# Altium project EECS430PhasedArray.PrjPcb
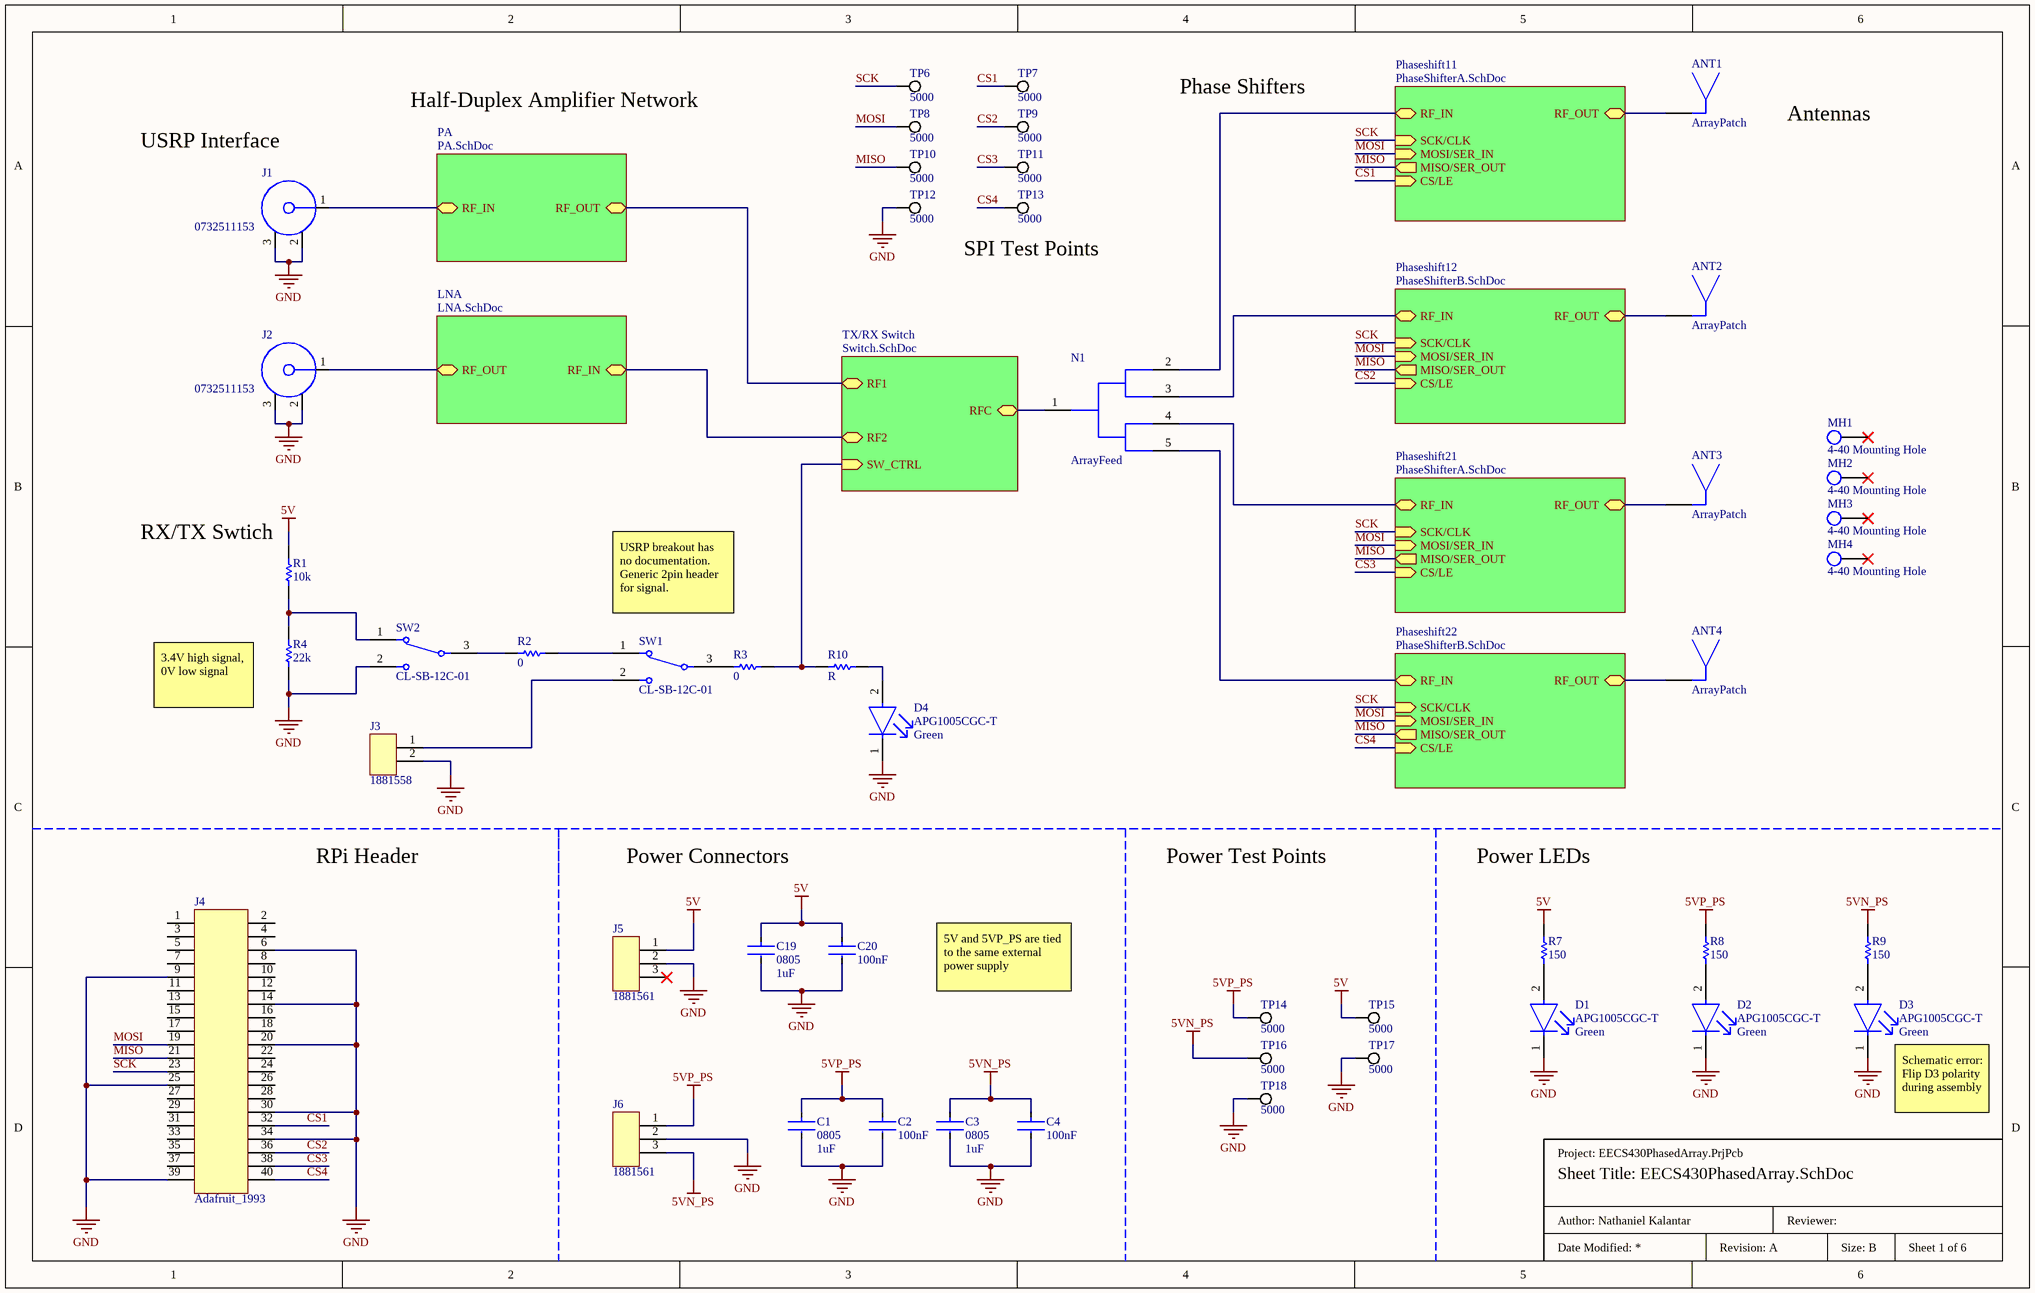
[diagram p0: EECS430PhasedArray.SchDoc]
SCH_REV: A; SCH_AUTHOR: Nathaniel Kalantar; PCB_REV: A; PCB_DESIGNER: Nathaniel Kalantar
6 sheets, 97 parts. Net scope: hierarchical (ports join the sheet entries above them; power ports are global).
Board file: EECS430PhasedArray.PcbDoc
Sheets:
  EECS430PhasedArray.SchDoc
    LNA = LNA.SchDoc
    PA = PA.SchDoc
    TX/RX Switch = Switch.SchDoc
    Phaseshift11 = PhaseShifterA.SchDoc
    Phaseshift12 = PhaseShifterB.SchDoc
    Phaseshift21 = PhaseShifterA.SchDoc
    Phaseshift22 = PhaseShifterB.SchDoc

## Sheet EECS430PhasedArray.SchDoc
size B; ENG_APP_DATE: --/--/--; DSN_APP_DATE: --/--/--; CHK_APP_DATE: --/--/--; Organization: MASA; SheetNumber: 1; SheetTotal: 6

### Parts
ANT1  ArrayPatch  [ArrayPatch]
ANT2  ArrayPatch  [ArrayPatch]
ANT3  ArrayPatch  [ArrayPatch]
ANT4  ArrayPatch  [ArrayPatch]
C1  value 1uF  Package: 0805  [FP-0805-Capacitor-CL21-IPC_B]  (hidden comment: Ceramic Capacitor 0805)
C2  value 100nF  [FP-0603-Capacitor-CL10-IPC_B]  (hidden comment: Ceramic Capacitor 0603)
C3  value 1uF  Package: 0805  [FP-0805-Capacitor-CL21-IPC_B]  (hidden comment: Ceramic Capacitor 0805)
C4  value 100nF  [FP-0603-Capacitor-CL10-IPC_B]  (hidden comment: Ceramic Capacitor 0603)
C19  value 1uF  Package: 0805  [FP-0805-Capacitor-CL21-IPC_B]  (hidden comment: Ceramic Capacitor 0805)
C20  value 100nF  [FP-0603-Capacitor-CL10-IPC_B]  (hidden comment: Ceramic Capacitor 0603)
D1  APG1005CGC-T  Color: Green  [FP-APG1005CGC-T-MFG]
D2  APG1005CGC-T  Color: Green  [FP-APG1005CGC-T-MFG]
D3  APG1005CGC-T  Color: Green  [FP-APG1005CGC-T-MFG]
D4  APG1005CGC-T  Color: Green  [FP-APG1005CGC-T-MFG]
J1  0732511153  [0732511153]
J2  0732511153  [0732511153]
J3  1881558  [1881558]
J4  Adafruit_1993  [Aadafruit_1993]
J5  1881561  [1881561]
J6  1881561  [1881561]
MH1  4-40 Mounting Hole  [4-40 Mounting Hole]
MH2  4-40 Mounting Hole  [4-40 Mounting Hole]
MH3  4-40 Mounting Hole  [4-40 Mounting Hole]
MH4  4-40 Mounting Hole  [4-40 Mounting Hole]
N1  ArrayFeed  [ArrayFeed]  (net tie, no BOM)
R1  value 10k  [RESC1608X55X25NL10T15]  (hidden comment: RC0603FR-072K2L)
R2  value 0  [RESC1608X55X25NL10T15]  (hidden comment: RC0603FR-072K2L)
R3  value 0  [RESC1608X55X25NL10T15]  (hidden comment: RC0603FR-072K2L)
R4  value 22k  [RESC1608X55X25NL10T15]  (hidden comment: RC0603FR-072K2L)
R7  value 150  [RESC1608X55X25NL10T15]  (hidden comment: RC0603FR-072K2L)
R8  value 150  [RESC1608X55X25NL10T15]  (hidden comment: RC0603FR-072K2L)
R9  value 150  [RESC1608X55X25NL10T15]  (hidden comment: RC0603FR-072K2L)
R10  value R  [RESC1608X55X25NL10T15]  (hidden comment: RC0603FR-072K2L)
SW1  CL-SB-12C-01  [CL-SB-12C-01]
SW2  CL-SB-12C-01  [CL-SB-12C-01]
TP6  5000  [FP-5000-MFG]
TP7  5000  [FP-5000-MFG]
TP8  5000  [FP-5000-MFG]
TP9  5000  [FP-5000-MFG]
TP10  5000  [FP-5000-MFG]
TP11  5000  [FP-5000-MFG]
TP12  5000  [FP-5000-MFG]
TP13  5000  [FP-5000-MFG]
TP14  5000  [FP-5000-MFG]
TP15  5000  [FP-5000-MFG]
TP16  5000  [FP-5000-MFG]
TP17  5000  [FP-5000-MFG]
TP18  5000  [FP-5000-MFG]

### Sub-sheets
LNA = LNA.SchDoc: RF_OUT (bidir), RF_IN (bidir)
PA = PA.SchDoc: RF_IN (bidir), RF_OUT (bidir)
Phaseshift11 = PhaseShifterA.SchDoc: SCK/CLK (in), MOSI/SER_IN (in), MISO/SER_OUT (out), CS/LE (in), RF_IN (bidir), RF_OUT (bidir)
Phaseshift12 = PhaseShifterB.SchDoc: SCK/CLK (in), MOSI/SER_IN (in), MISO/SER_OUT (out), CS/LE (in), RF_IN (bidir), RF_OUT (bidir)
Phaseshift21 = PhaseShifterA.SchDoc: SCK/CLK (in), MOSI/SER_IN (in), MISO/SER_OUT (out), CS/LE (in), RF_IN (bidir), RF_OUT (bidir)
Phaseshift22 = PhaseShifterB.SchDoc: SCK/CLK (in), MOSI/SER_IN (in), MISO/SER_OUT (out), CS/LE (in), RF_IN (bidir), RF_OUT (bidir)
TX/RX Switch = Switch.SchDoc: RFC (bidir), RF1 (bidir), RF2 (bidir), SW_CTRL (in)

### Nets
5V: C19.1 C20.1 J5.1 R1.2 R7.2 TP15.1
5VN_PS: C3.1 C4.1 J6.3 R9.1 TP16.1
5VP_PS: C1.1 C2.1 J6.1 R8.2 TP14.1
GND: C1.2 C2.2 C3.2 C4.2 C19.2 C20.2 D1.1(C) D2.1(C) D3.1(C) D4.1(C) J1.2 J1.3 J2.2 J2.3 J3.2 J4.6 J4.9 J4.14 J4.20 J4.25 J4.30 J4.34 J4.39 J5.2 J6.2 R4.1 SW2.2 TP12.1 TP17.1 TP18.1
CS1: J4.32 TP7.1 ; sheet Phaseshift11/CS/LE
CS2: J4.36 TP9.1 ; sheet Phaseshift12/CS/LE
CS3: J4.38 TP11.1 ; sheet Phaseshift21/CS/LE
CS4: J4.40 TP13.1 ; sheet Phaseshift22/CS/LE
MISO: J4.21 TP10.1 ; sheet Phaseshift11/MISO/SER_OUT, sheet Phaseshift12/MISO/SER_OUT, sheet Phaseshift21/MISO/SER_OUT, sheet Phaseshift22/MISO/SER_OUT
MOSI: J4.19 TP8.1 ; sheet Phaseshift11/MOSI/SER_IN, sheet Phaseshift12/MOSI/SER_IN, sheet Phaseshift21/MOSI/SER_IN, sheet Phaseshift22/MOSI/SER_IN
SCK: J4.23 TP6.1 ; sheet Phaseshift11/SCK/CLK, sheet Phaseshift12/SCK/CLK, sheet Phaseshift21/SCK/CLK, sheet Phaseshift22/SCK/CLK
NetANT1_1: ANT1.1(ANT) ; sheet Phaseshift11/RF_OUT
NetANT2_1: ANT2.1(ANT) ; sheet Phaseshift12/RF_OUT
NetANT3_1: ANT3.1(ANT) ; sheet Phaseshift21/RF_OUT
NetANT4_1: ANT4.1(ANT) ; sheet Phaseshift22/RF_OUT
NetC8_1: sheet LNA/RF_IN, sheet TX/RX Switch/RF2
NetC16_1: R3.1 R10.2 ; sheet TX/RX Switch/SW_CTRL
NetD1_2: D1.2(A) R7.1
NetD2_2: D2.2(A) R8.1
NetD3_2: D3.2(A) R9.2
NetD4_2: D4.2(A) R10.1
NetJ1_1: J1.1 ; sheet PA/RF_IN
NetJ2_1: J2.1 ; sheet LNA/RF_OUT
NetJ3_1: J3.1 SW1.2
NetN1_1: N1.1(RFC) ; sheet TX/RX Switch/RFC
NetN1_2: N1.2(RF1) ; sheet Phaseshift11/RF_IN
NetN1_3: N1.3(RF2) ; sheet Phaseshift12/RF_IN
NetN1_4: N1.4(RF3) ; sheet Phaseshift21/RF_IN
NetN1_5: N1.5(RF4) ; sheet Phaseshift22/RF_IN
NetR1_1: R1.1 R4.2 SW2.1
NetR2_1: R2.1 SW1.1
NetR2_2: R2.2 SW2.3
NetR3_2: R3.2 SW1.3
NetU2_5: sheet PA/RF_OUT, sheet TX/RX Switch/RF1

Not connected (* = marked no-connect by the designer): J4 1 2 3 4 5 7 8 10 11 12 13 15 16 17 18 22 24 26 27 28 29 31 33 35 37; J5 3*; MH1 1*; MH2 1*; MH3 1*; MH4 1*

### Notes on the sheet
- Half-Duplex Amplifier Network
- Phase Shifters
- USRP Interface
- Antennas
- (near TP13) SPI Test Points
- (near R1) RX/TX Swtich
- USRP breakout has no documentation.
  Generic 2pin header for signal.
- (near R4) 3.4V high signal, 0V low signal
- RPi Header
- Power Connectors
- Power Test Points
- Power LEDs
- 5V and 5VP_PS are tied to the same external power supply
- (near D3) Schematic error:
  Flip D3 polarity during assembly
- Size: B

### Library data of the parts
ANT1-ANT4 = ArrayPatch: Copper footprint for patch antenna element
C1 C3 C19 = Ceramic Capacitor 0805: CAP CER 50V X7R 0805; Manufacturer: KEMET; Manufacturer Part Number: C0603C104K5RACTU; Tolerance: 0.1; Temperature Coefficient: 30ppm/°C; Automotive Grade: Grade 1; Temperature: -55°C to +125°C; RoHS: TRUE; Material: Ceramic; Temperature Range High: +125°C; Lead Free: Yes; Octopart: https://octopart.com/c0603c104k5ractu-kemet-139244; Digikey Description: CAP CER 0.1UF 50V X7R 0603; Category: Cap; ComponentLink2Description: Datasheet; Temperature Range Low: -55°C; Device Class L1: Passive Components; Voltage Rating: 50 V; Automotive: Yes; Device Class L3: Ceramic Capacitors; ComponentLink2URL: https://api.kemet.com/component-edge/download/datasheet/C0603C100J5GACAUTO.pdf; Device Class L2: Capacitors; Temperature Characteristic: X7R; Height: 0.87mm; Supplier 1: Arrow Electronics; Supplier Part Number 1: CL21B105KBFNNNG
C2 C4 C20 = Ceramic Capacitor 0603: CAP CER 50V X7R 0603; Manufacturer: KEMET; Manufacturer Part Number: C0603C104K5RACTU; Tolerance: 0.1; Temperature Coefficient: 30ppm/°C; Automotive Grade: Grade 1; Temperature: -55°C to +125°C; RoHS: TRUE; Material: Ceramic; Temperature Range High: +125°C; Lead Free: Yes; Octopart: https://octopart.com/c0603c104k5ractu-kemet-139244; Digikey Description: CAP CER 0.1UF 50V X7R 0603; Category: Cap; Package: C0603C-CF; ComponentLink2Description: Datasheet; Temperature Range Low: -55°C; Device Class L1: Passive Components; Voltage Rating: 50 V; Automotive: Yes; Device Class L3: Ceramic Capacitors; ComponentLink2URL: https://api.kemet.com/component-edge/download/datasheet/C0603C100J5GACAUTO.pdf; Device Class L2: Capacitors; Temperature Characteristic: X7R; Height: 0.87mm; Supplier 1: Arrow Electronics; Supplier Part Number 1: CL10B104KB8NNNC
D1-D4 = APG1005CGC-T: LED GREEN CLEAR CHIP SMD; Forward Voltage: 2V; Lens Color: Colorless; Test Current: 20mA; Dominant Wavelength: 571nm; Viewing Angle: 120°; Luminous Intensity: 35mcd; Width: 0.5mm; Case Code (Imperial): 0402; Package Quantity: 1; Case/Package: 0402; Packaging: Tape and Reel; Height: 0.25mm; Mount: Surface Mount; Case Code (Metric): 1005; Length: 1mm; Lead Free: Lead Free; Lens Transparency: Clear; Supplier 1: Digi-Key; Supplier Part Number 1: 754-1811-1-ND
J1 J2 = 0732511153: SMA Connector Jack, Female Socket 50 Ohms Board Edge, End Launch Solder
J3 = 1881558: 2 Position Terminal Block Header, Male Pins, Shrouded (4 Side) 0.098" (2.50mm) Vertical Through Hole; Supplier 1: Mouser; Supplier Part Number 1: 651-1881558
J4 = Adafruit_1993: 2x20 pin Male IDC Box Header - Raspberry Pi A+/B+/Pi 2/Pi 3/Pi 4
J5 J6 = 1881561: 3 Position Terminal Block Header, Male Pins, Shrouded (4 Side) 0.098" (2.50mm) Vertical Through Hole; Supplier 1: Mouser; Supplier Part Number 1: 651-1881561
N1 = ArrayFeed: Copper net tie for 1:4 splitter/combiner
R1-R4 R7-R10 = Resistor 0603: Thick Film Resistor, 2.2 KOhm, 100 mW, 50 V, +/- 1%, -55 to 155 degC, 2-Pin SMD (0603), RoHS, Tape and Reel; Manufacturer: Yageo; Temperature Coefficient: 100PPM/C; Voltage Rating: 50V; Power Rating: 100mW; Tolerance: 1%; Datasheet Version: Rev. 7, 05/2017; Case Code - mm: 1608; Series: RC; Mounting Technology: SurfaceMount; Package Description: 2-Pin Surface Mount Device, Body 1.6 x 0.8 mm; Case Code - in: 0603; Package Reference: 0603; Product: ThickFilmResistorsGeneralPurpose; Manufacturer URL: http://www.yageo.com/; Termination Style: SMD/SMT; Operating Temperature Range: -55Cto+155C; Datasheet URL: http://www.yageo.com/documents/recent/PYu-RC_Group_51_RoHS_L_7.pdf; Packaging: Reel
SW1 SW2 = CL-SB-12C-01: Slide Switch SPDT Through Hole; Supplier 1: Newark; Supplier Part Number 1: 97AH8227
TP6-TP18 = 5000: Red PC Test Point, Miniature Phosphor Bronze Silver Plating Through Hole Mounting Type; Connector Type: Interconnection Device; Contact Finish - Termination: Silver (Ag); Reach SVHC Compliant: Yes; JESD-609 Code: e4; RoHS Compliant: Yes; Pins: 1; Mounting Technology: THT; Supplier 1: Future Electronics; Supplier Part Number 1: 8000564

## Sheet LNA.SchDoc
size B; Organization: MASA; SheetNumber: 2; SheetTotal: 6
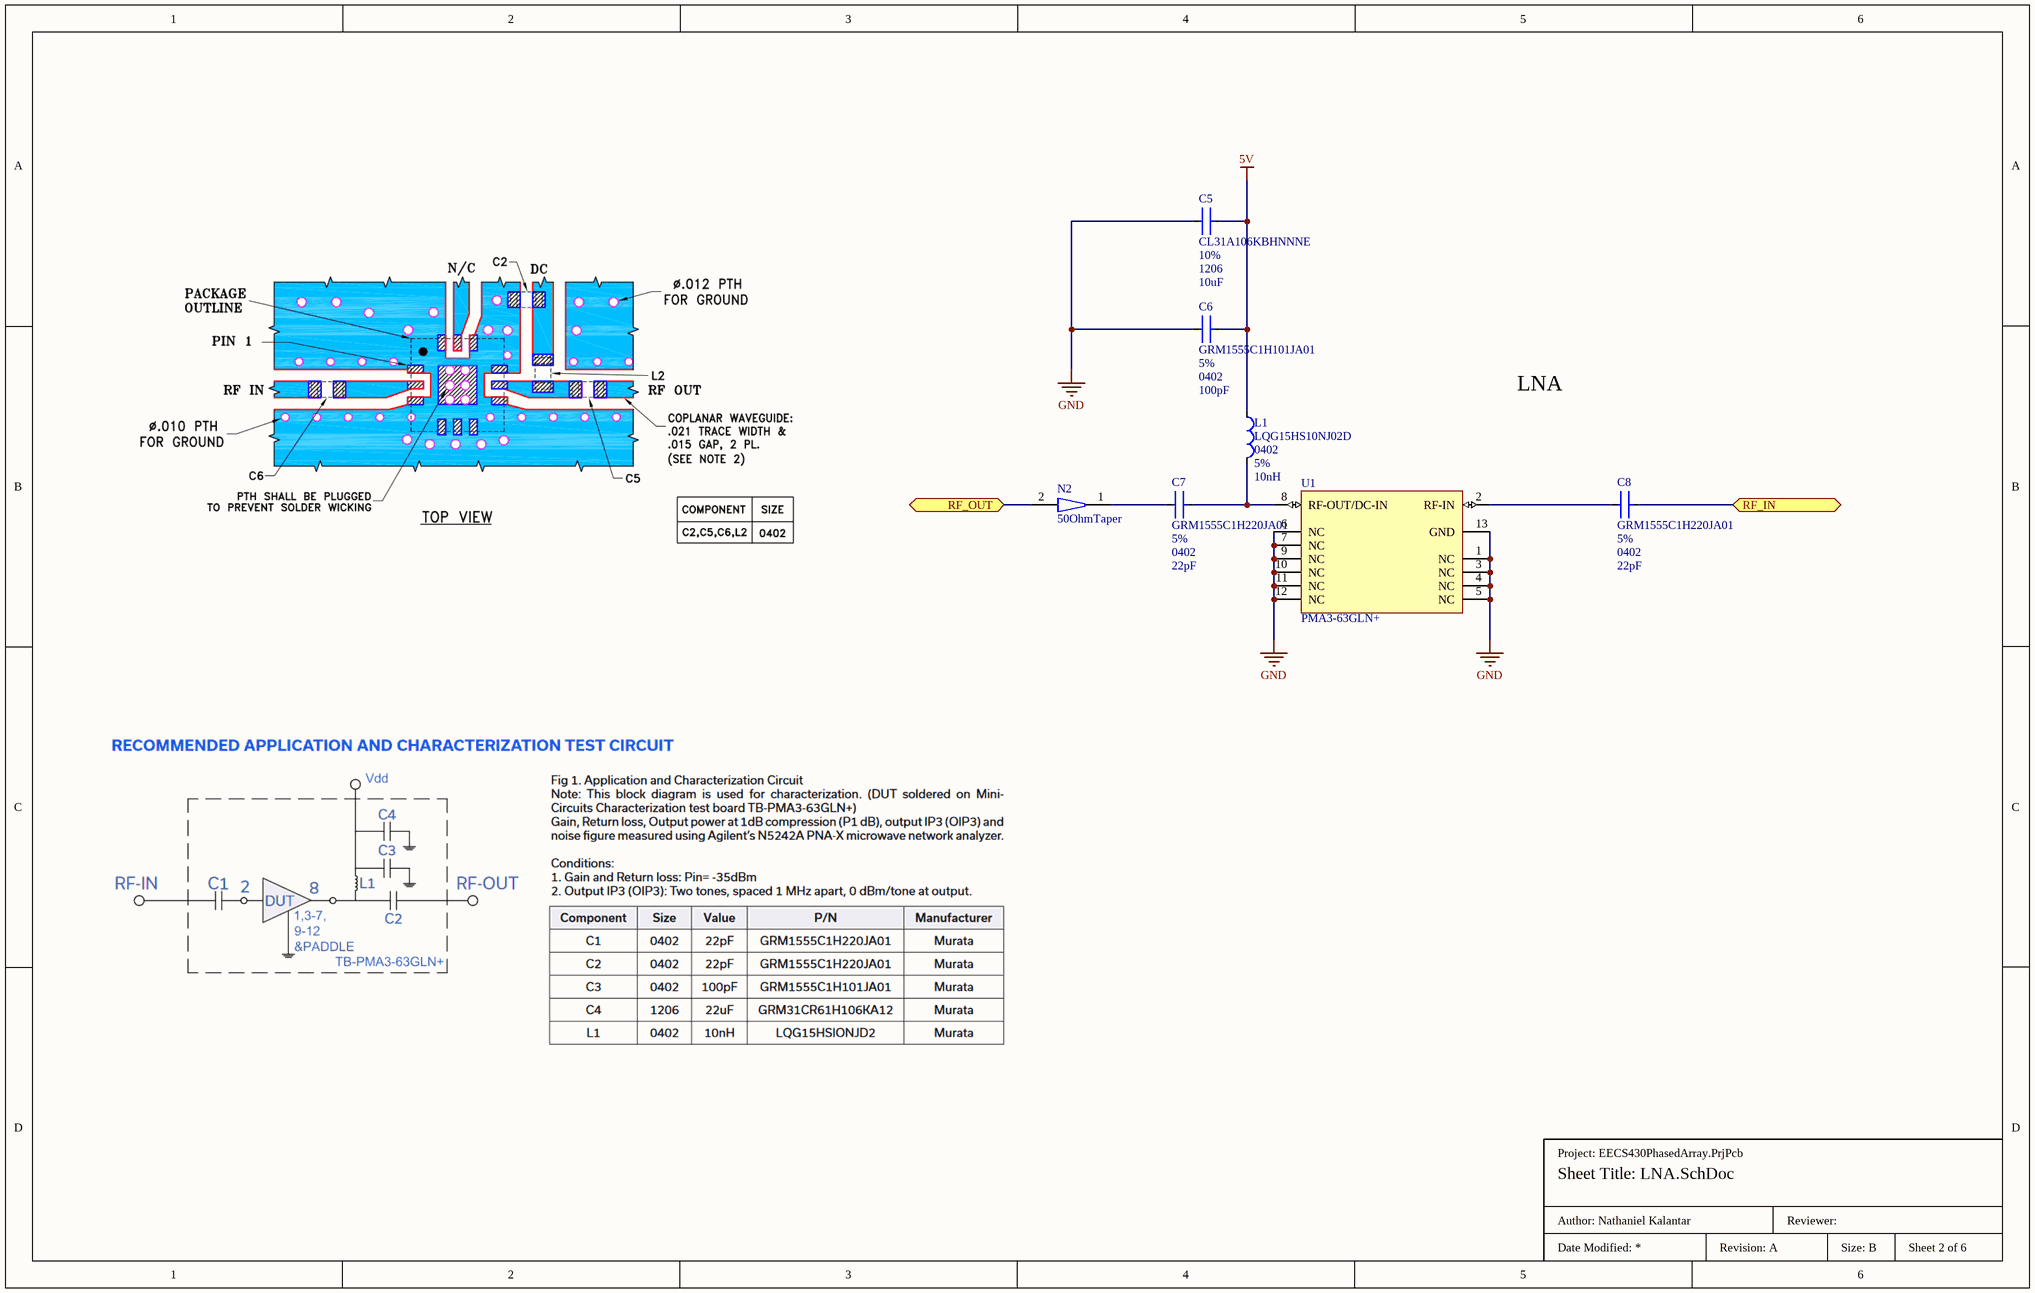
[diagram p1: LNA.SchDoc]

### Parts
C5  CL31A106KBHNNNE  value 10uF  Tolerance: 10%  Package: 1206  [Capactor1206_Samsung]
C6  GRM1555C1H101JA01  value 100pF  Tolerance: 5%  Package: 0402  [Capacitor0402_Murata]
C7  GRM1555C1H220JA01  value 22pF  Tolerance: 5%  Package: 0402  [Capacitor0402_Murata]
C8  GRM1555C1H220JA01  value 22pF  Tolerance: 5%  Package: 0402  [Capacitor0402_Murata]
L1  LQG15HS10NJ02D  Case Code (Imperial): 0402  Tolerance: 5%  Inductance: 10nH  [FP-LQG15HH_02-IPC_B]
N2  50OhmTaper  [50OhmTaper]  (net tie, no BOM)
U1  PMA3-63GLN+  [PMA3-63GLN+-QFN127P600-8N]

### Ports
RF_IN (bidir), RF_OUT (bidir)

### Nets
5V: C5.1 C6.1 L1.2
GND: C5.2 C6.2 U1.1(NC) U1.3(NC) U1.4(NC) U1.5(NC) U1.6(NC) U1.7(NC) U1.9(NC) U1.10(NC) U1.11(NC) U1.12(NC) U1.13(GND)
NetC7_1: C7.1 L1.1 U1.8(RF-OUT/DC-IN)
NetC7_2: C7.2 N2.1
NetC8_1: C8.1 ; port RF_IN
NetC8_2: C8.2 U1.2(RF-IN)
NetJ2_1: N2.2 ; port RF_OUT

### Notes on the sheet
- LNA
- Size: B

### Library data of the parts
C5 = CL31A106KBHNNNE: 10 µF ±10% 50V Ceramic Capacitor X5R 1206 (3216 Metric); Automotive Grade: Grade 1; RoHS: TRUE; Material: Ceramic; Temperature Range High: +125°C; Lead Free: Yes; Category: Cap; ComponentLink2Description: Datasheet; Temperature Range Low: -55°C; Device Class L1: Passive Components; Voltage Rating: 50 V; Automotive: Yes; Device Class L3: Ceramic Capacitors; ComponentLink2URL: https://api.kemet.com/component-edge/download/datasheet/C0603C100J5GACAUTO.pdf; Device Class L2: Capacitors; Temperature Characteristic: X5R; Supplier 1: Arrow Electronics; Supplier Part Number 1: CL31A106KBHNNNE
C6 = GRM1555C1H101JA01: 100 pF ±5% 50V Ceramic Capacitor C0G, NP0 0402 (1005 Metric); Automotive Grade: Grade 1; Temperature Characteristic: X7R; RoHS: TRUE; Material: Ceramic; Temperature Range High: +125°C; Lead Free: Yes; Category: Cap; ComponentLink2Description: Datasheet; Temperature Range Low: -55°C; Device Class L1: Passive Components; Voltage Rating: 50 V; Automotive: Yes; Device Class L3: Ceramic Capacitors; ComponentLink2URL: https://api.kemet.com/component-edge/download/datasheet/C0603C100J5GACAUTO.pdf; Device Class L2: Capacitors; Supplier 1: Avnet; Supplier Part Number 1: GRM1555C1H101JA01D
C7 C8 = GRM1555C1H220JA01: 22 pF ±5% 50V Ceramic Capacitor C0G, NP0 0402 (1005 Metric); Automotive Grade: Grade 1; Temperature Characteristic: X7R; RoHS: TRUE; Material: Ceramic; Temperature Range High: +125°C; Lead Free: Yes; Category: Cap; ComponentLink2Description: Datasheet; Temperature Range Low: -55°C; Device Class L1: Passive Components; Voltage Rating: 50 V; Automotive: Yes; Device Class L3: Ceramic Capacitors; ComponentLink2URL: https://api.kemet.com/component-edge/download/datasheet/C0603C100J5GACAUTO.pdf; Device Class L2: Capacitors; Supplier 1: Avnet; Supplier Part Number 1: GRM1555C1H220JA01D
L1 = LQG15HS10NJ02D: Multilayer type RF Inductor 10nH ±5% 0.26Ω 500mA 0402; DC Resistance (DCR): 260mR; DC Current: 300mA; Shielding: Unshielded; Q Factor: 8; Test Frequency: 100MHz; Self Resonant Frequency: 3.4GHz; Core Material: Air; Width: 0.5mm; Radiation Hardening: No; Packaging: Tape and Reel; Lead Free: Lead Free; Military Standard: Not; Case/Package: 0402; Current Rating: 300mA; Case Code (Metric): 1005; Length: 0.039inch; Termination: SMD/SMT; Max DC Current: 300mA; Max Operating Temperature: 125°C; Mount: Surface Mount; Height - Seated (Max): 0.022inch; Package Quantity: 10000; Height: 0.5mm; Depth: 0.55mm; Min Operating Temperature: -55°C; Supplier 1: Arrow Electronics; Supplier Part Number 1: LQG15HS10NJ02D
N2 = 50OhmTaper: Triangular taper from 50 Ohms to 0402 width
U1 = PMA3-63GLN+: RF Amplifier IC LTE, Radar, SATCOM, UMTS, WiFi, WiMAX, WLAN 1.8GHz ~ 6GHz 12-MCLP (3x3); Supplier 1: Digikey; Supplier Part Number 1: 3157-PMA3-63GLN+CT-ND

## Sheet PA.SchDoc
size B; Organization: MASA; SheetNumber: 3; SheetTotal: 6
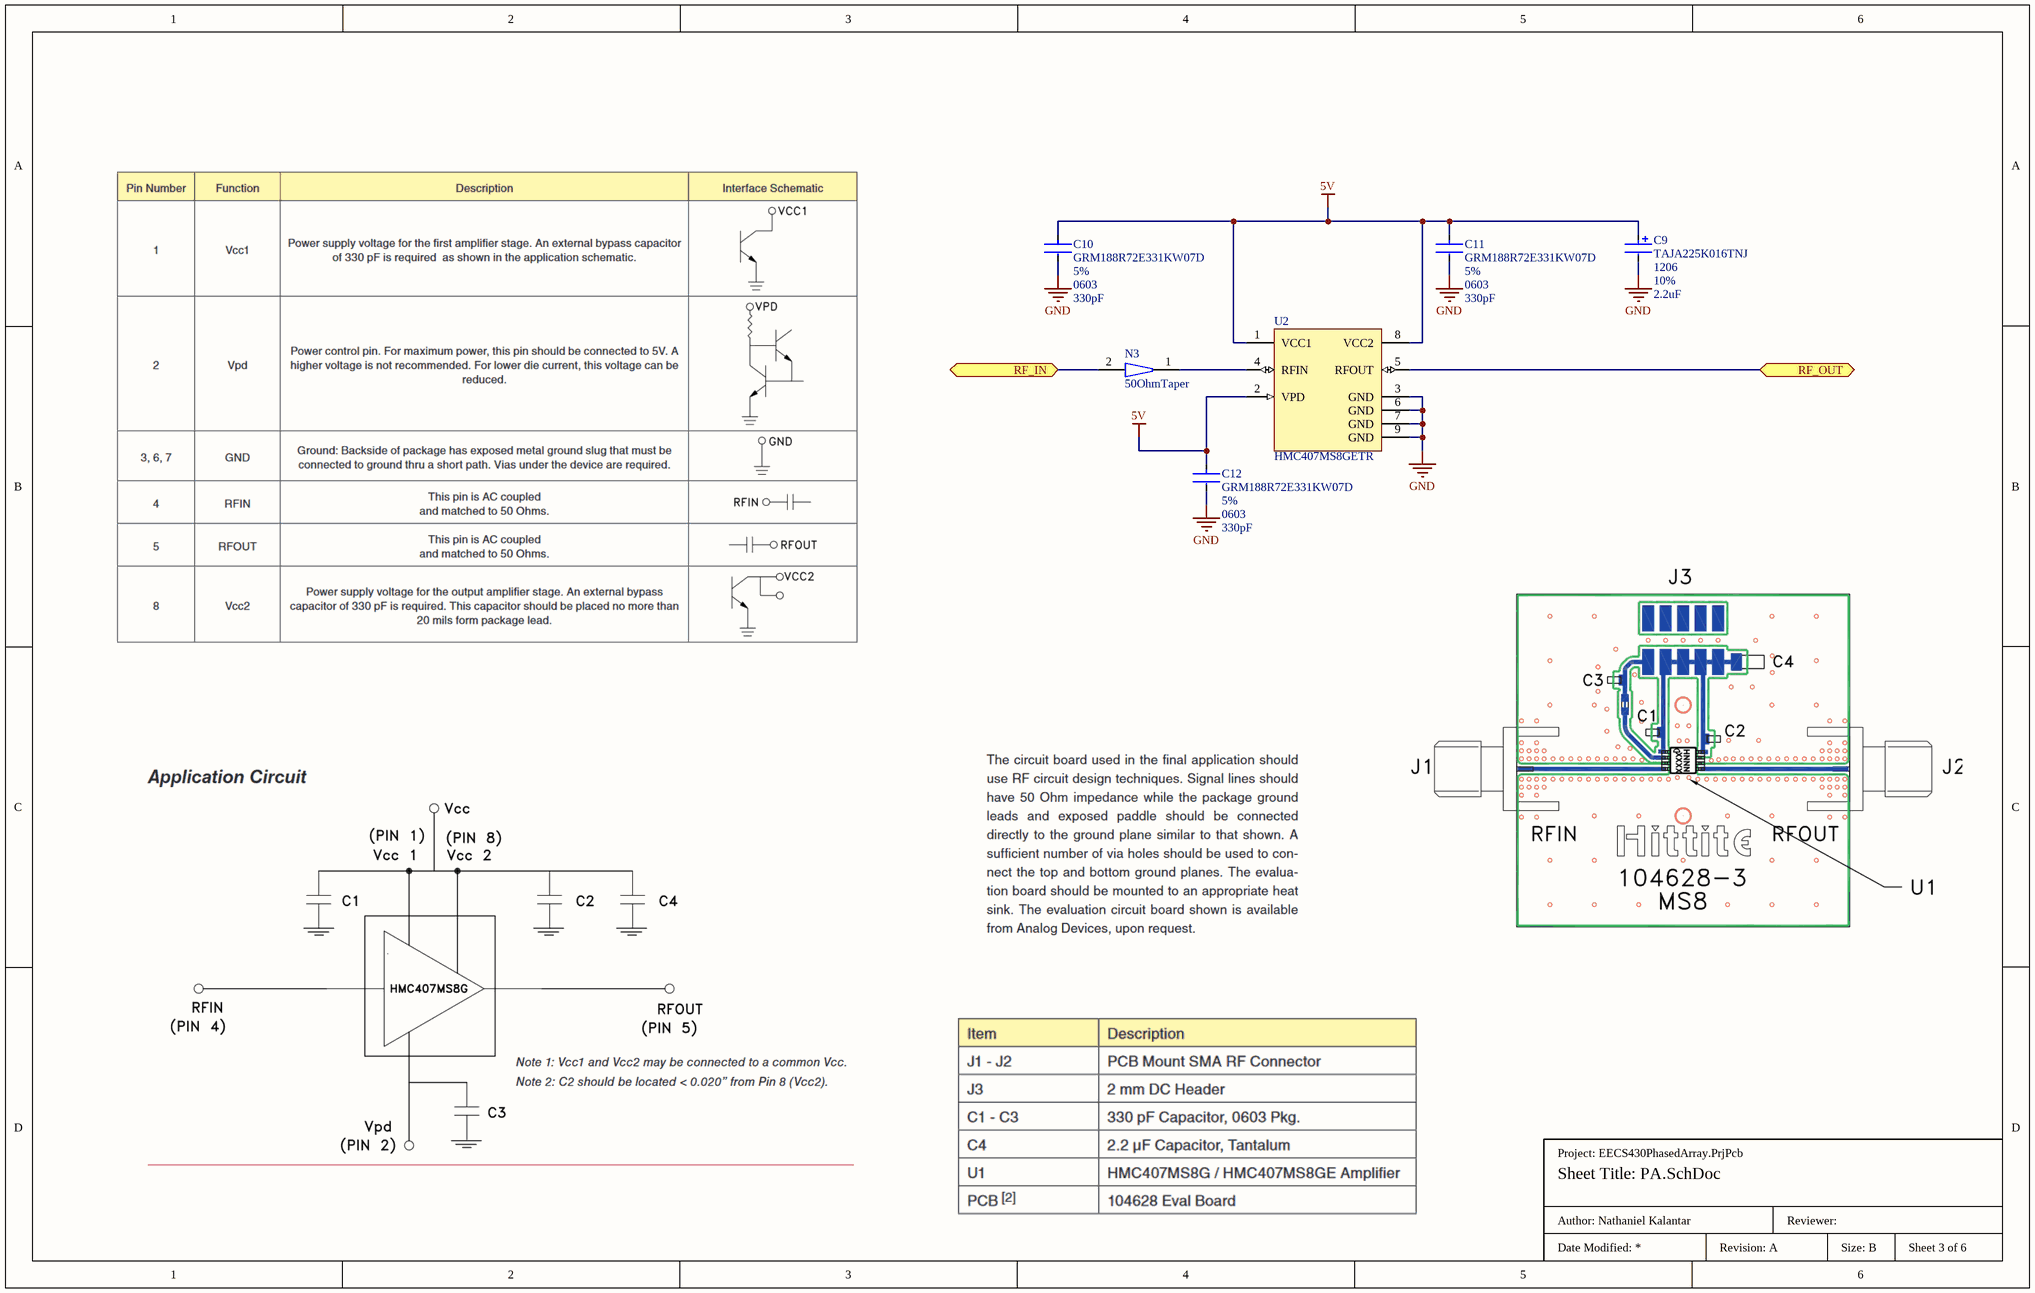
[diagram p2: PA.SchDoc]

### Parts
C9  TAJA225K016TNJ  value 2.2uF  Package: 1206  Tolerance: 10%  [TantCapKyocera1206]
C10  GRM188R72E331KW07D  value 330pF  Tolerance: 5%  Package: 0603  [Murata0603CeramicCap]
C11  GRM188R72E331KW07D  value 330pF  Tolerance: 5%  Package: 0603  [Murata0603CeramicCap]
C12  GRM188R72E331KW07D  value 330pF  Tolerance: 5%  Package: 0603  [Murata0603CeramicCap]
N3  50OhmTaper  [50OhmTaper]  (net tie, no BOM)
U2  HMC407MS8GETR  [HMC407MS8GETR]

### Ports
RF_IN (bidir), RF_OUT (bidir)

### Nets
5V: C9.1 C10.1 C11.1 C12.1 U2.1(VCC1) U2.2(VPD) U2.8(VCC2)
GND: C9.2 C10.2 C11.2 C12.2 U2.3(GND) U2.6(GND) U2.7(GND) U2.9(GND)
NetJ1_1: N3.2 ; port RF_IN
NetN3_1: N3.1 U2.4(RFIN)
NetU2_5: U2.5(RFOUT) ; port RF_OUT

### Notes on the sheet
- Size: B

### Library data of the parts
C9 = TAJA225K016TNJ: 2.2 µF Molded Tantalum Capacitors 16 V 1206 (3216 Metric) 6.5Ohm @ 100kHz; Manufacturer: Kyocera AVX; Manufacturer Part Number: TPSB226K020T0400; Supplier: Future Electronics; Supplier Part Number: 9110023; RoHS: Yes; Category: Tantalum Capacitors; Stock: 2000; Pricing: 2000=0.3, 4000=0.29, 6000=0.29, 8000=0.285, 10000=0.28 (USD); Pins: 2; Dielectric Material: Tantalum; Capacitor Type: Tantalum; Reach SVHC Compliant: Yes; RoHS Compliant: Yes; ComponentLink1URL: https://datasheet.ciiva.com:443/pdfs/VipMasterIC/IC/AVXC/AVXC-S-A0008672189/AVXC-S-A0008672189-1.pdf?src-supplier=IHS+Markit; ComponentLink1Description: https://datasheet.ciiva.com:443/pdfs/VipMasterIC/IC/AVXC/AVXC-S-A0008672189/AVXC-S-A0008672189-1.pdf?src-supplier=IHS+Markit; Supplier 1: Newark; Supplier Part Number 1: 67AK1283
C10-C12 = GRM188R72E331KW07D: 330 pF ±10% 250V Ceramic Capacitor X7R 0603 (1608 Metric); Automotive Grade: Grade 1; RoHS: TRUE; Material: Ceramic; Temperature Range High: +125°C; Lead Free: Yes; Category: Cap; ComponentLink2Description: Datasheet; Temperature Range Low: -55°C; Device Class L1: Passive Components; Voltage Rating: 250 V; Automotive: Yes; Device Class L3: Ceramic Capacitors; ComponentLink2URL: https://api.kemet.com/component-edge/download/datasheet/C0603C100J5GACAUTO.pdf; Device Class L2: Capacitors; Temperature Characteristic: X7R; Supplier 1: Avnet; Supplier Part Number 1: GRM1555C1H101JA01D
N3 = 50OhmTaper: as N2 on sheet LNA
U2 = HMC407MS8GETR: RF Amplifier IC General Purpose 5GHz ~ 7GHz 8-MSOP-EP; Supplier 1: Mouser; Supplier Part Number 1: 584-HMC407MS8GETR

## Sheet Switch.SchDoc
size B; Organization: MASA; SheetNumber: 5; SheetTotal: 6
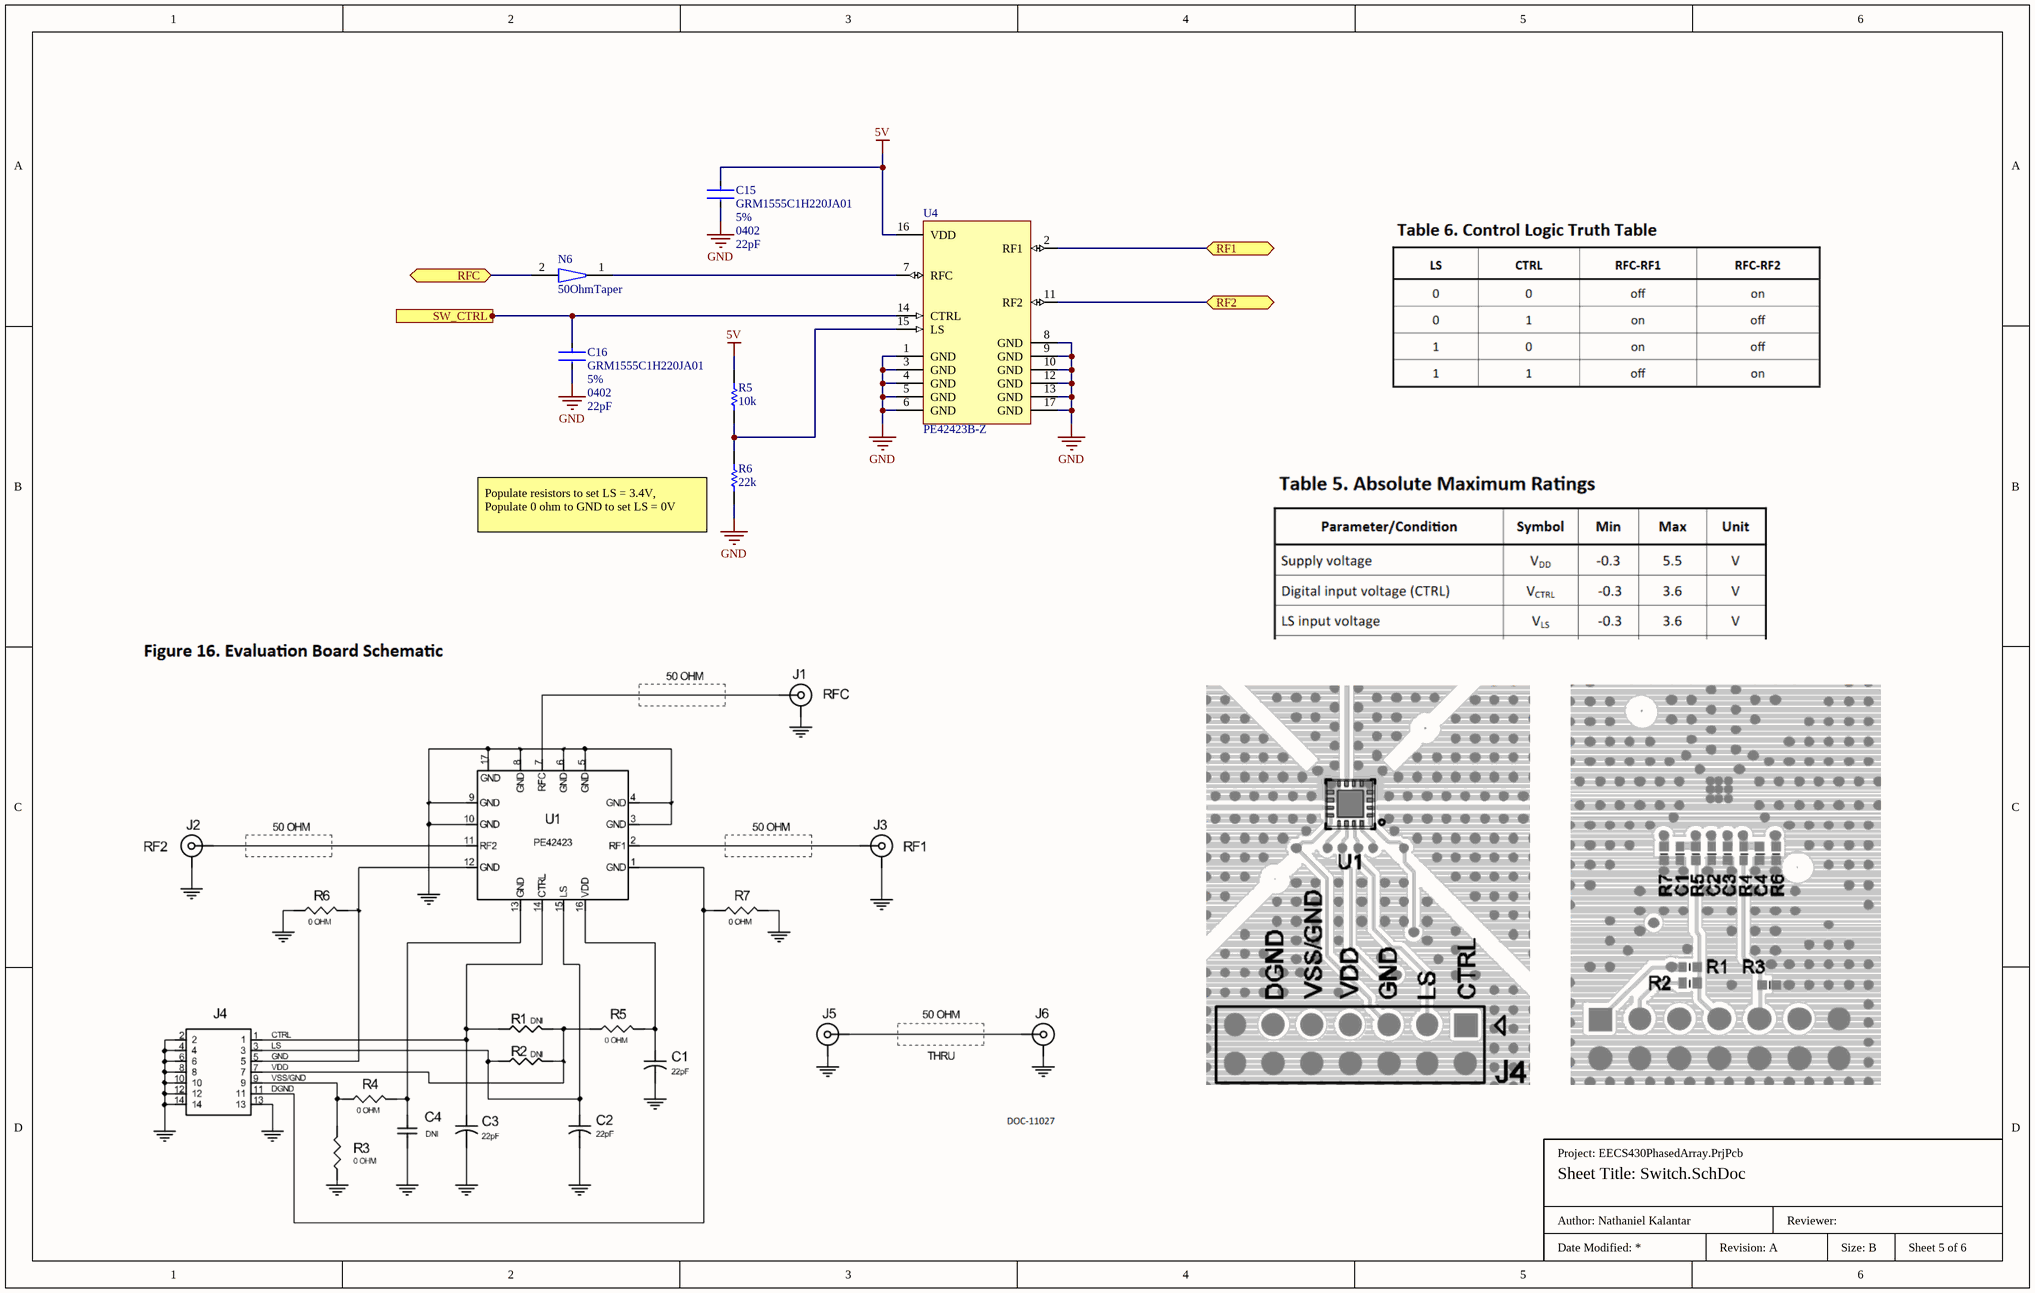
[diagram p3: Switch.SchDoc]

### Parts
C15  GRM1555C1H220JA01  value 22pF  Tolerance: 5%  Package: 0402  [Capacitor0402_Murata]
C16  GRM1555C1H220JA01  value 22pF  Tolerance: 5%  Package: 0402  [Capacitor0402_Murata]
N6  50OhmTaper  [50OhmTaper]  (net tie, no BOM)
R5  value 10k  [RESC1608X55X25NL10T15]  (hidden comment: RC0603FR-072K2L)
R6  value 22k  [RESC1608X55X25NL10T15]  (hidden comment: RC0603FR-072K2L)
U4  PE42423B-Z  [PE42423-QFN127P600-8N]

### Ports
RF1 (bidir), RF2 (bidir), RFC (bidir), SW_CTRL (in)

### Nets
5V: C15.1 R5.2 U4.16(VDD)
GND: C15.2 C16.2 R6.1 U4.1(GND) U4.3(GND) U4.4(GND) U4.5(GND) U4.6(GND) U4.8(GND) U4.9(GND) U4.10(GND) U4.12(GND) U4.13(GND) U4.17(GND)
NetC8_1: U4.11(RF2) ; port RF2
NetC16_1: C16.1 U4.14(CTRL) ; port SW_CTRL
NetN1_1: N6.2 ; port RFC
NetN6_1: N6.1 U4.7(RFC)
NetR5_1: R5.1 R6.2 U4.15(LS)
NetU2_5: U4.2(RF1) ; port RF1

### Notes on the sheet
- (near R6) Populate resistors to set LS = 3.4V,
  Populate 0 ohm to GND to set LS = 0V
- Size: B

### Library data of the parts
C15 C16 = GRM1555C1H220JA01: as C7 on sheet LNA; RoHS: TRUE; Material: Ceramic; Temperature Range High: +125°C; Lead Free: Yes; Category: Cap; ComponentLink2Description: Datasheet; Temperature Range Low: -55°C; Device Class L1: Passive Components; Voltage Rating: 50 V; Automotive: Yes; Device Class L3: Ceramic Capacitors; ComponentLink2URL: https://api.kemet.com/component-edge/download/datasheet/C0603C100J5GACAUTO.pdf; Device Class L2: Capacitors; Supplier 1: Avnet; Supplier Part Number 1: GRM1555C1H220JA01D
N6 = 50OhmTaper: as N2 on sheet LNA
R5 R6 = Resistor 0603: as R1 on sheet EECS430PhasedArray; Tolerance: 1%; Datasheet Version: Rev. 7, 05/2017; Case Code - mm: 1608; Series: RC; Mounting Technology: SurfaceMount; Package Description: 2-Pin Surface Mount Device, Body 1.6 x 0.8 mm; Case Code - in: 0603; Package Reference: 0603; Product: ThickFilmResistorsGeneralPurpose; Manufacturer URL: http://www.yageo.com/; Termination Style: SMD/SMT; Operating Temperature Range: -55Cto+155C; Datasheet URL: http://www.yageo.com/documents/recent/PYu-RC_Group_51_RoHS_L_7.pdf; Packaging: Reel
U4 = PE42423B-Z: RF Switch IC 802.11a/b/g/n/ac SPDT 6 GHz 50Ohm 16-QFN (3x3); Supplier 1: Digikey; Supplier Part Number 1: 1046-1103-1-ND

## Sheet PhaseShifterA.SchDoc
size B; Organization: MASA; SheetNumber: 4; SheetTotal: 6
Used 2 times, as channels Phaseshift11, Phaseshift21. Parts and nets are listed once, with the designators drawn on the sheet.
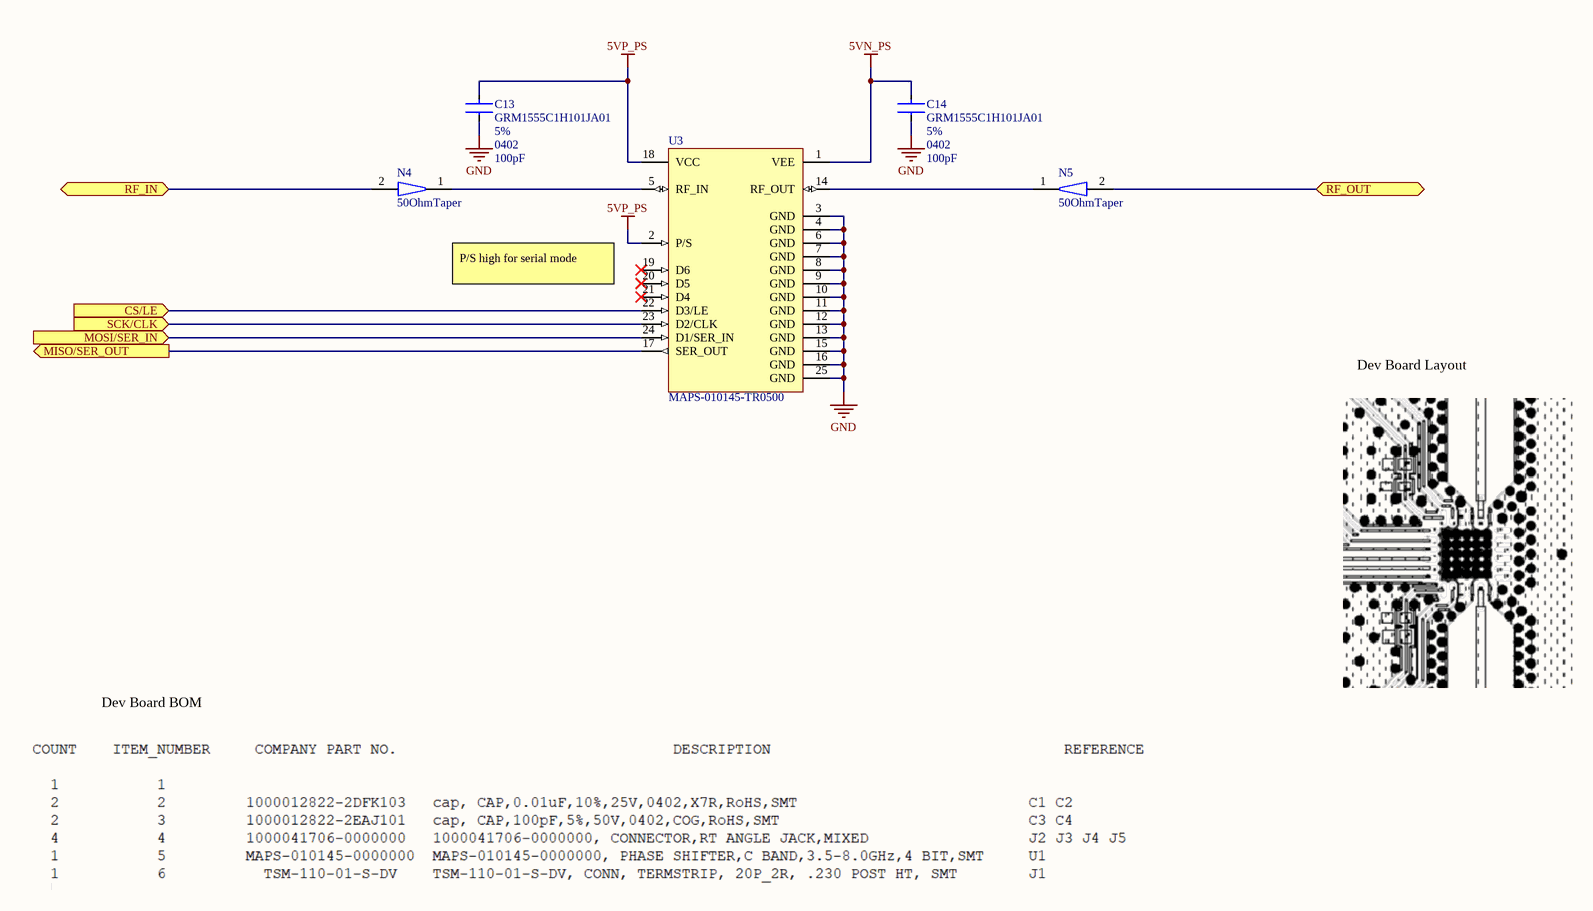
[diagram p4: PhaseShifterA.SchDoc]

### Parts
C13  GRM1555C1H101JA01  value 100pF  Tolerance: 5%  Package: 0402  [Capacitor0402_Murata]
C14  GRM1555C1H101JA01  value 100pF  Tolerance: 5%  Package: 0402  [Capacitor0402_Murata]
N4  50OhmTaper  [50OhmTaper]  (net tie, no BOM)
N5  50OhmTaper  [50OhmTaper]  (net tie, no BOM)
U3  MAPS-010145-TR0500  [MAPS-010145-TR0500_QFN50P400X400X100_HS-25N]

### Ports
CS/LE (in), MISO/SER_OUT (out), MOSI/SER_IN (in), RF_IN (bidir), RF_OUT (bidir), SCK/CLK (in)

### Nets
5VN_PS: C14.1 U3.1(VEE)
5VP_PS: C13.1 U3.2(P/S) U3.18(VCC)
GND: C13.2 C14.2 U3.3(GND) U3.4(GND) U3.6(GND) U3.7(GND) U3.8(GND) U3.9(GND) U3.10(GND) U3.11(GND) U3.12(GND) U3.13(GND) U3.15(GND) U3.16(GND) U3.25(GND)
CS/LE: U3.22(D3/LE) ; port CS/LE
MISO/SER_OUT: U3.17(SER_OUT) ; port MISO/SER_OUT
MOSI/SER_IN: U3.24(D1/SER_IN) ; port MOSI/SER_IN
RF_IN: N4.2 ; port RF_IN
RF_OUT: N5.2 ; port RF_OUT
SCK/CLK: U3.23(D2/CLK) ; port SCK/CLK
NetN4_1: N4.1 U3.5(RF_IN)
NetN5_1: N5.1 U3.14(RF_OUT)

Not connected (* = marked no-connect by the designer): U3 19(D6)* 20(D5)* 21(D4)*

### Channels
Phaseshift11: designators end in .1; ports CS/LE=CS1 MISO/SER_OUT=MISO MOSI/SER_IN=MOSI RF_IN=NetN1_2 RF_OUT=NetANT1_1 SCK/CLK=SCK
Phaseshift21: designators end in .2; ports CS/LE=CS3 MISO/SER_OUT=MISO MOSI/SER_IN=MOSI RF_IN=NetN1_4 RF_OUT=NetANT3_1 SCK/CLK=SCK

### Notes on the sheet
- P/S high for serial mode
- Dev Board Layout
- Dev Board BOM
- Size: B

### Library data of the parts
C13 C14 = GRM1555C1H101JA01: as C6 on sheet LNA; RoHS: TRUE; Material: Ceramic; Temperature Range High: +125°C; Lead Free: Yes; Category: Cap; ComponentLink2Description: Datasheet; Temperature Range Low: -55°C; Device Class L1: Passive Components; Voltage Rating: 50 V; Automotive: Yes; Device Class L3: Ceramic Capacitors; ComponentLink2URL: https://api.kemet.com/component-edge/download/datasheet/C0603C100J5GACAUTO.pdf; Device Class L2: Capacitors; Supplier 1: Avnet; Supplier Part Number 1: GRM1555C1H101JA01D
N4 N5 = 50OhmTaper: as N2 on sheet LNA
U3 = MAPS-010145-TR0500: Phase Detectors / Shifters 3.5-6.0GHz 4-Bit Step 22.5 deg.; Supplier 1: Mouser; Supplier Part Number 1: 937-MAPS-010145-T5

## Sheet PhaseShifterB.SchDoc
size B; Organization: MASA; SheetNumber: 6; SheetTotal: 6
Used 2 times, as channels Phaseshift12, Phaseshift22. Parts and nets are listed once, with the designators drawn on the sheet.
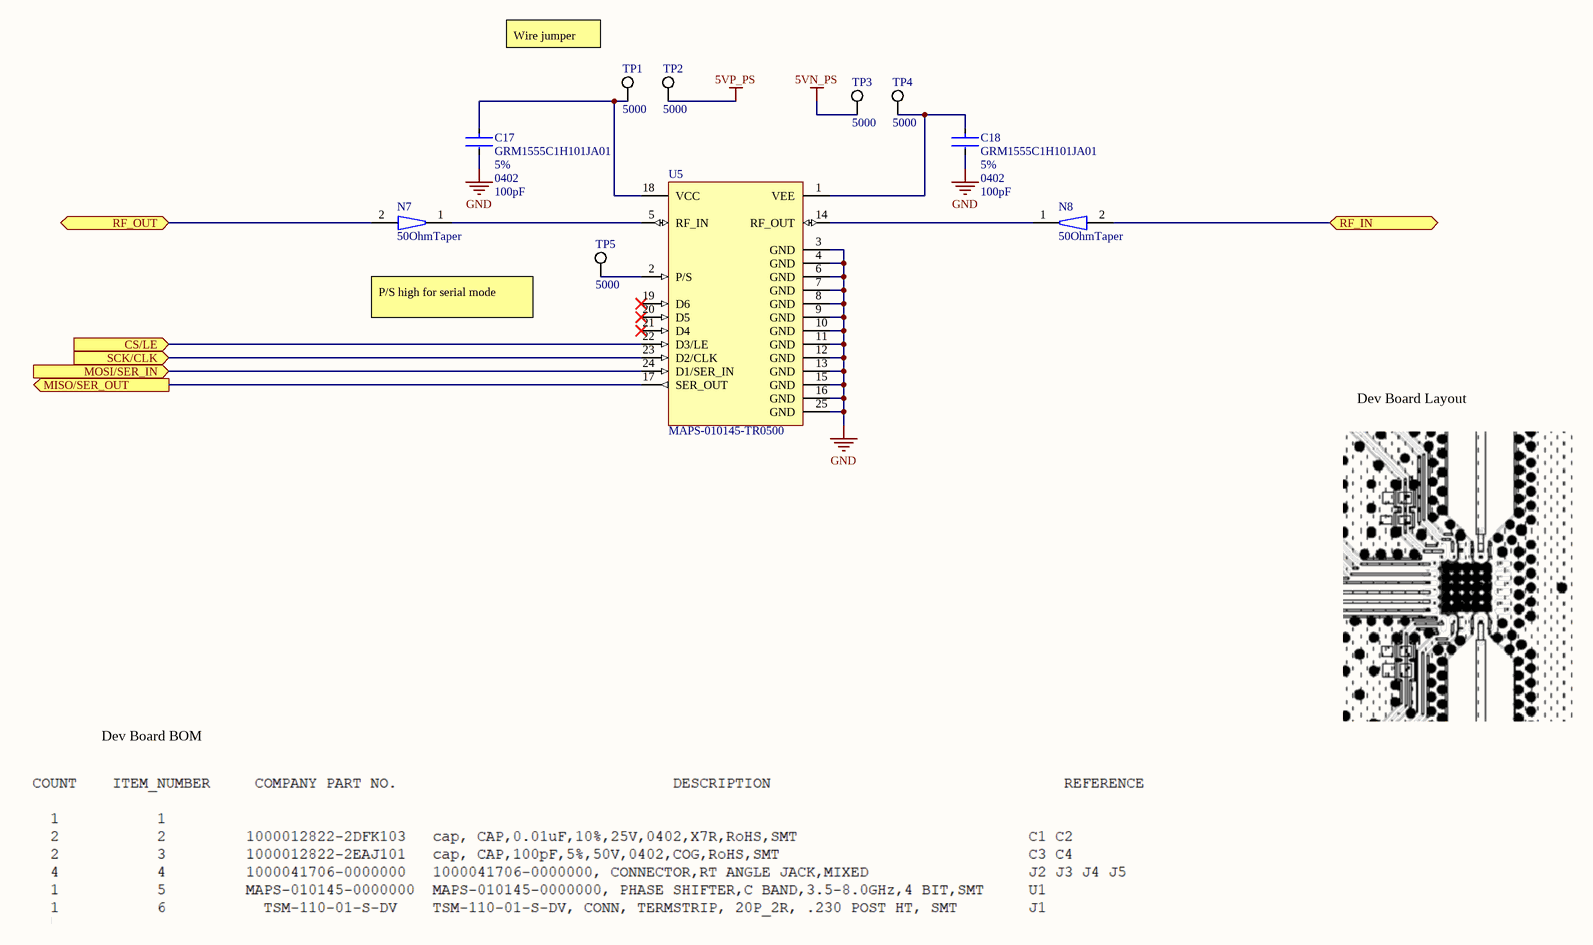
[diagram p5: PhaseShifterB.SchDoc]

### Parts
C17  GRM1555C1H101JA01  value 100pF  Tolerance: 5%  Package: 0402  [Capacitor0402_Murata]
C18  GRM1555C1H101JA01  value 100pF  Tolerance: 5%  Package: 0402  [Capacitor0402_Murata]
N7  50OhmTaper  [50OhmTaper]  (net tie, no BOM)
N8  50OhmTaper  [50OhmTaper]  (net tie, no BOM)
TP1  5000  [FP-5000-MFG]
TP2  5000  [FP-5000-MFG]
TP3  5000  [FP-5000-MFG]
TP4  5000  [FP-5000-MFG]
TP5  5000  [FP-5000-MFG]
U5  MAPS-010145-TR0500  [MAPS-010145-TR0500_QFN50P400X400X100_HS-25N]

### Ports
CS/LE (in), MISO/SER_OUT (out), MOSI/SER_IN (in), RF_IN (bidir), RF_OUT (bidir), SCK/CLK (in)

### Nets
5VN_PS: TP3.1
5VP_PS: TP2.1
GND: C17.2 C18.2 U5.3(GND) U5.4(GND) U5.6(GND) U5.7(GND) U5.8(GND) U5.9(GND) U5.10(GND) U5.11(GND) U5.12(GND) U5.13(GND) U5.15(GND) U5.16(GND) U5.25(GND)
CS/LE: U5.22(D3/LE) ; port CS/LE
MISO/SER_OUT: U5.17(SER_OUT) ; port MISO/SER_OUT
MOSI/SER_IN: U5.24(D1/SER_IN) ; port MOSI/SER_IN
RF_IN: N8.2 ; port RF_IN
RF_OUT: N7.2 ; port RF_OUT
SCK/CLK: U5.23(D2/CLK) ; port SCK/CLK
NetC17_1: C17.1 TP1.1 U5.18(VCC)
NetC18_1: C18.1 TP4.1 U5.1(VEE)
NetN7_1: N7.1 U5.5(RF_IN)
NetN8_1: N8.1 U5.14(RF_OUT)
NetTP5_1: TP5.1 U5.2(P/S)

Not connected (* = marked no-connect by the designer): U5 19(D6)* 20(D5)* 21(D4)*

### Channels
Phaseshift12: designators end in .1; ports CS/LE=CS2 MISO/SER_OUT=MISO MOSI/SER_IN=MOSI RF_IN=NetN1_3 RF_OUT=NetANT2_1 SCK/CLK=SCK
Phaseshift22: designators end in .2; ports CS/LE=CS4 MISO/SER_OUT=MISO MOSI/SER_IN=MOSI RF_IN=NetN1_5 RF_OUT=NetANT4_1 SCK/CLK=SCK

### Notes on the sheet
- (near TP1) Wire jumper
- P/S high for serial mode
- Dev Board Layout
- Dev Board BOM
- Size: B

### Library data of the parts
C17 C18 = GRM1555C1H101JA01: as C6 on sheet LNA; RoHS: TRUE; Material: Ceramic; Temperature Range High: +125°C; Lead Free: Yes; Category: Cap; ComponentLink2Description: Datasheet; Temperature Range Low: -55°C; Device Class L1: Passive Components; Voltage Rating: 50 V; Automotive: Yes; Device Class L3: Ceramic Capacitors; ComponentLink2URL: https://api.kemet.com/component-edge/download/datasheet/C0603C100J5GACAUTO.pdf; Device Class L2: Capacitors; Supplier 1: Avnet; Supplier Part Number 1: GRM1555C1H101JA01D
N7 N8 = 50OhmTaper: as N2 on sheet LNA
TP1-TP5 = 5000: as TP6 on sheet EECS430PhasedArray; Contact Finish - Termination: Silver (Ag); Reach SVHC Compliant: Yes; JESD-609 Code: e4; RoHS Compliant: Yes; Pins: 1; Mounting Technology: THT; Supplier 1: Future Electronics; Supplier Part Number 1: 8000564
U5 = MAPS-010145-TR0500: as U3 on sheet PhaseShifterA; Supplier 1: Mouser; Supplier Part Number 1: 937-MAPS-010145-T5

## Nets that join several sheets
5V: EECS430PhasedArray (6 pins), LNA (C5.1 C6.1 L1.2), PA (7 pins), Switch (C15.1 R5.2 U4.16)
5VN_PS: EECS430PhasedArray (5 pins), Phaseshift11 (C14.1.1 U3.1.1), Phaseshift12 (TP3.1.1), Phaseshift21 (C14.2.1 U3.2.1), Phaseshift22 (TP3.2.1)
5VP_PS: EECS430PhasedArray (5 pins), Phaseshift11 (C13.1.1 U3.1.2 U3.1.18), Phaseshift12 (TP2.1.1), Phaseshift21 (C13.2.1 U3.2.2 U3.2.18), Phaseshift22 (TP2.2.1)
GND: EECS430PhasedArray (30 pins), LNA (13 pins), PA (8 pins), Switch (14 pins), Phaseshift11 (15 pins), Phaseshift12 (15 pins), Phaseshift21 (15 pins), Phaseshift22 (15 pins)
CS1: EECS430PhasedArray (J4.32 TP7.1), Phaseshift11 (U3.1.22)
CS2: EECS430PhasedArray (J4.36 TP9.1), Phaseshift12 (U5.1.22)
CS3: EECS430PhasedArray (J4.38 TP11.1), Phaseshift21 (U3.2.22)
CS4: EECS430PhasedArray (J4.40 TP13.1), Phaseshift22 (U5.2.22)
MISO: EECS430PhasedArray (J4.21 TP10.1), Phaseshift11 (U3.1.17), Phaseshift12 (U5.1.17), Phaseshift21 (U3.2.17), Phaseshift22 (U5.2.17)
MOSI: EECS430PhasedArray (J4.19 TP8.1), Phaseshift11 (U3.1.24), Phaseshift12 (U5.1.24), Phaseshift21 (U3.2.24), Phaseshift22 (U5.2.24)
NetANT1_1: EECS430PhasedArray (ANT1.1), Phaseshift11 (N5.1.2)
NetANT2_1: EECS430PhasedArray (ANT2.1), Phaseshift12 (N7.1.2)
NetANT3_1: EECS430PhasedArray (ANT3.1), Phaseshift21 (N5.2.2)
NetANT4_1: EECS430PhasedArray (ANT4.1), Phaseshift22 (N7.2.2)
NetC8_1: LNA (C8.1), Switch (U4.11)
NetC16_1: EECS430PhasedArray (R3.1 R10.2), Switch (C16.1 U4.14)
NetJ1_1: EECS430PhasedArray (J1.1), PA (N3.2)
NetJ2_1: EECS430PhasedArray (J2.1), LNA (N2.2)
NetN1_1: EECS430PhasedArray (N1.1), Switch (N6.2)
NetN1_2: EECS430PhasedArray (N1.2), Phaseshift11 (N4.1.2)
NetN1_3: EECS430PhasedArray (N1.3), Phaseshift12 (N8.1.2)
NetN1_4: EECS430PhasedArray (N1.4), Phaseshift21 (N4.2.2)
NetN1_5: EECS430PhasedArray (N1.5), Phaseshift22 (N8.2.2)
NetU2_5: PA (U2.5), Switch (U4.2)
SCK: EECS430PhasedArray (J4.23 TP6.1), Phaseshift11 (U3.1.23), Phaseshift12 (U5.1.23), Phaseshift21 (U3.2.23), Phaseshift22 (U5.2.23)